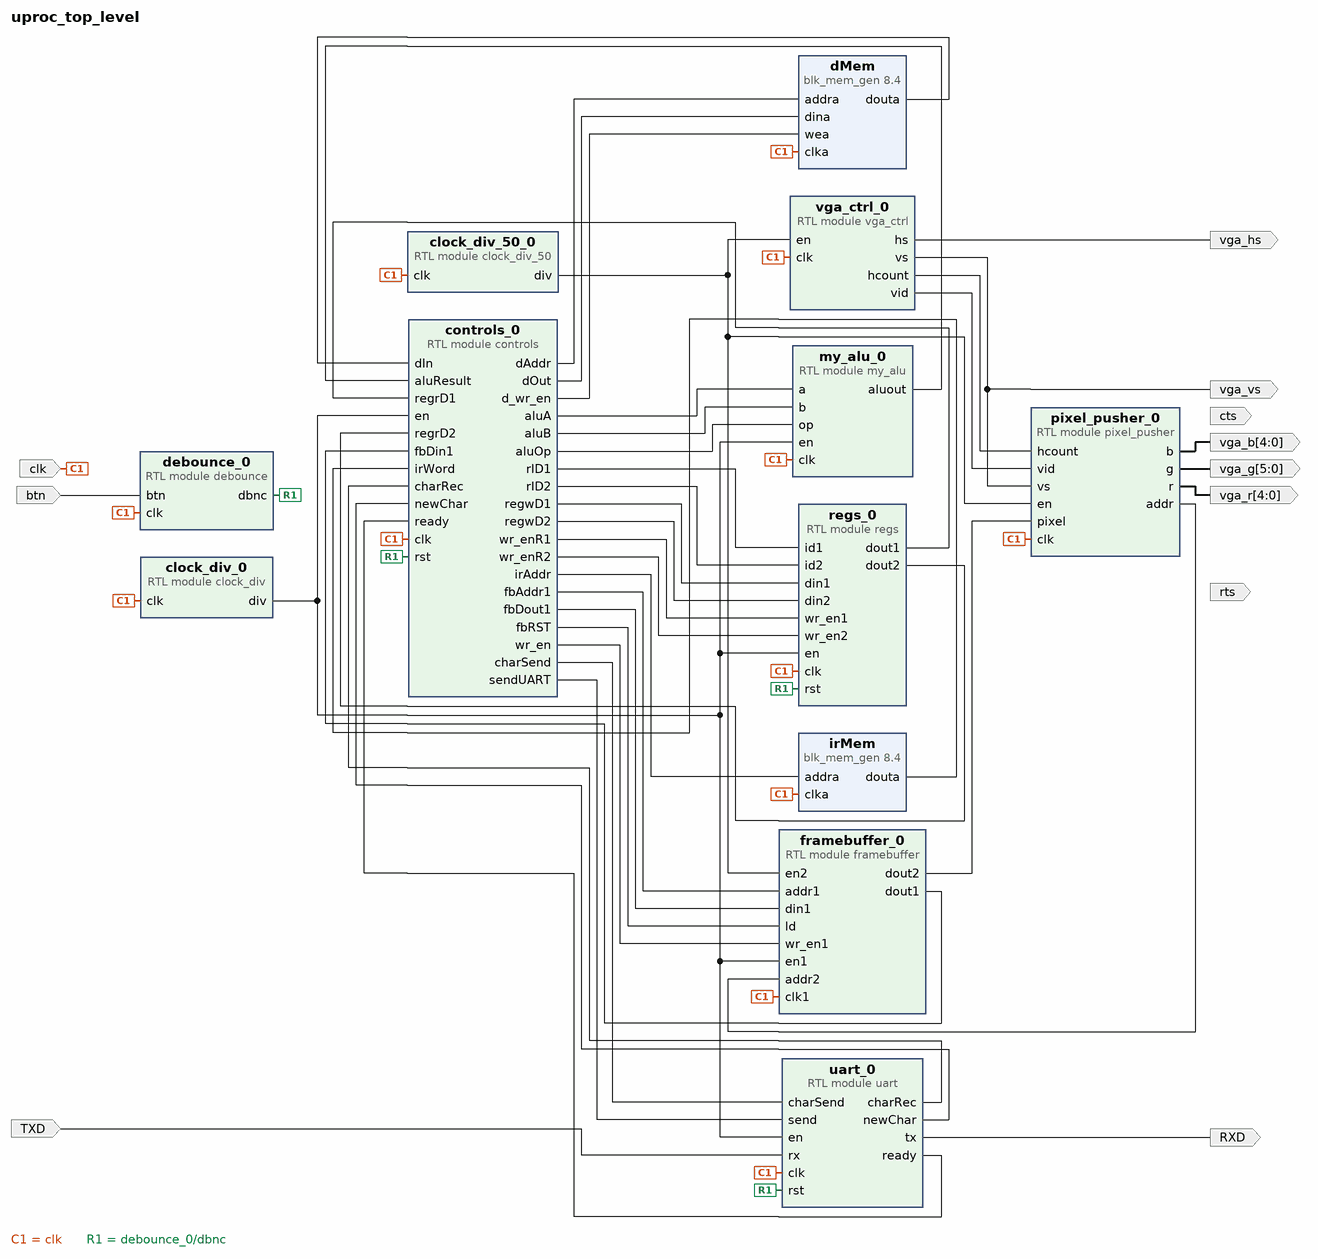
[diagram p0: block diagram of the top level]
# Vivado block design uproc_top_level, xc7z010clg400-1, Vivado 2021.1
create_bd_design uproc_top_level

create_bd_port -dir I -type clk clk
set_property -dict {CONFIG.FREQ_HZ 125000000} [get_bd_ports clk]
create_bd_port -dir I btn
create_bd_port -dir O vga_vs
create_bd_port -dir O vga_hs
create_bd_port -dir O -from 4 -to 0 vga_r
create_bd_port -dir O -from 4 -to 0 vga_b
create_bd_port -dir O -from 5 -to 0 vga_g
create_bd_port -dir O RXD
create_bd_port -dir I TXD
create_bd_port -dir O rts
create_bd_port -dir O cts

create_bd_cell -type module -reference regs regs_0
create_bd_cell -type module -reference vga_ctrl vga_ctrl_0
create_bd_cell -type module -reference framebuffer framebuffer_0
create_bd_cell -type module -reference clock_div clock_div_0
create_bd_cell -type module -reference clock_div_50 clock_div_50_0
create_bd_cell -type module -reference debounce debounce_0
create_bd_cell -type module -reference uart uart_0
create_bd_cell -type ip -vlnv xilinx.com:ip:blk_mem_gen:8.4 irMem
set_property -dict [list \
  CONFIG.Coe_File ../../../../../../../Downloads/drive-download-20250425T001836Z-001/output_text.coe \
  CONFIG.Enable_32bit_Address false \
  CONFIG.Enable_A Always_Enabled \
  CONFIG.Load_Init_File true \
  CONFIG.Memory_Type Single_Port_ROM \
  CONFIG.Port_A_Write_Rate 0 \
  CONFIG.Register_PortA_Output_of_Memory_Primitives true \
  CONFIG.Use_RSTA_Pin false \
  CONFIG.Write_Depth_A 16384 \
  CONFIG.use_bram_block Stand_Alone \
] [get_bd_cells irMem]
create_bd_cell -type ip -vlnv xilinx.com:ip:blk_mem_gen:8.4 dMem
set_property -dict [list \
  CONFIG.Coe_File ../../../../../../../Downloads/drive-download-20250425T001836Z-001/output_data.coe \
  CONFIG.Enable_32bit_Address false \
  CONFIG.Enable_A Always_Enabled \
  CONFIG.Load_Init_File true \
  CONFIG.Read_Width_A 16 \
  CONFIG.Register_PortA_Output_of_Memory_Primitives false \
  CONFIG.Use_Byte_Write_Enable false \
  CONFIG.Use_RSTA_Pin false \
  CONFIG.Write_Depth_A 32768 \
  CONFIG.Write_Width_A 16 \
  CONFIG.use_bram_block Stand_Alone \
] [get_bd_cells dMem]
create_bd_cell -type module -reference my_alu my_alu_0
create_bd_cell -type module -reference pixel_pusher pixel_pusher_0
create_bd_cell -type module -reference controls controls_0

# ---- connections ----

connect_bd_net -net btn_0_1 [get_bd_ports btn] [get_bd_pins debounce_0/btn]
connect_bd_net [get_bd_ports clk] \
  [get_bd_pins clock_div_0/clk] [get_bd_pins clock_div_50_0/clk] [get_bd_pins regs_0/clk] [get_bd_pins framebuffer_0/clk1] \
  [get_bd_pins vga_ctrl_0/clk] [get_bd_pins uart_0/clk] [get_bd_pins dMem/clka] [get_bd_pins irMem/clka] \
  [get_bd_pins debounce_0/clk] [get_bd_pins my_alu_0/clk] [get_bd_pins pixel_pusher_0/clk] [get_bd_pins controls_0/clk]
connect_bd_net [get_bd_pins clock_div_0/div] \
  [get_bd_pins framebuffer_0/en1] [get_bd_pins regs_0/en] [get_bd_pins uart_0/en] [get_bd_pins my_alu_0/en] \
  [get_bd_pins controls_0/en]
connect_bd_net [get_bd_pins clock_div_50_0/div] [get_bd_pins framebuffer_0/en2] [get_bd_pins vga_ctrl_0/en] [get_bd_pins pixel_pusher_0/en]
connect_bd_net [get_bd_pins controls_0/aluA] [get_bd_pins my_alu_0/a]
connect_bd_net [get_bd_pins controls_0/aluB] [get_bd_pins my_alu_0/b]
connect_bd_net [get_bd_pins controls_0/aluOp] [get_bd_pins my_alu_0/op]
connect_bd_net [get_bd_pins controls_0/charSend] [get_bd_pins uart_0/charSend]
connect_bd_net [get_bd_pins controls_0/dAddr] [get_bd_pins dMem/addra]
connect_bd_net [get_bd_pins controls_0/dOut] [get_bd_pins dMem/dina]
connect_bd_net [get_bd_pins controls_0/d_wr_en] [get_bd_pins dMem/wea]
connect_bd_net [get_bd_pins controls_0/fbAddr1] [get_bd_pins framebuffer_0/addr1]
connect_bd_net [get_bd_pins controls_0/fbDout1] [get_bd_pins framebuffer_0/din1]
connect_bd_net [get_bd_pins controls_0/fbRST] [get_bd_pins framebuffer_0/ld]
connect_bd_net [get_bd_pins controls_0/irAddr] [get_bd_pins irMem/addra]
connect_bd_net [get_bd_pins controls_0/rID1] [get_bd_pins regs_0/id1]
connect_bd_net [get_bd_pins controls_0/rID2] [get_bd_pins regs_0/id2]
connect_bd_net [get_bd_pins controls_0/regwD1] [get_bd_pins regs_0/din1]
connect_bd_net [get_bd_pins controls_0/regwD2] [get_bd_pins regs_0/din2]
connect_bd_net [get_bd_pins controls_0/sendUART] [get_bd_pins uart_0/send]
connect_bd_net [get_bd_pins controls_0/wr_en] [get_bd_pins framebuffer_0/wr_en1]
connect_bd_net [get_bd_pins controls_0/wr_enR1] [get_bd_pins regs_0/wr_en1]
connect_bd_net [get_bd_pins controls_0/wr_enR2] [get_bd_pins regs_0/wr_en2]
connect_bd_net [get_bd_pins dMem/douta] [get_bd_pins controls_0/dIn]
connect_bd_net [get_bd_pins debounce_0/dbnc] [get_bd_pins regs_0/rst] [get_bd_pins uart_0/rst] [get_bd_pins controls_0/rst]
connect_bd_net [get_bd_pins framebuffer_0/dout1] [get_bd_pins controls_0/fbDin1]
connect_bd_net [get_bd_pins framebuffer_0/dout2] [get_bd_pins pixel_pusher_0/pixel]
connect_bd_net [get_bd_pins irMem/douta] [get_bd_pins controls_0/irWord]
connect_bd_net -net my_alu_0_output [get_bd_pins my_alu_0/aluout] [get_bd_pins controls_0/aluResult]
connect_bd_net [get_bd_pins pixel_pusher_0/addr] [get_bd_pins framebuffer_0/addr2]
connect_bd_net [get_bd_pins pixel_pusher_0/b] [get_bd_ports vga_b]
connect_bd_net [get_bd_pins pixel_pusher_0/g] [get_bd_ports vga_g]
connect_bd_net [get_bd_pins pixel_pusher_0/r] [get_bd_ports vga_r]
connect_bd_net [get_bd_pins regs_0/dout1] [get_bd_pins controls_0/regrD1]
connect_bd_net [get_bd_pins regs_0/dout2] [get_bd_pins controls_0/regrD2]
connect_bd_net -net rx_0_1 [get_bd_ports TXD] [get_bd_pins uart_0/rx]
connect_bd_net [get_bd_pins uart_0/charRec] [get_bd_pins controls_0/charRec]
connect_bd_net [get_bd_pins uart_0/newChar] [get_bd_pins controls_0/newChar]
connect_bd_net [get_bd_pins uart_0/ready] [get_bd_pins controls_0/ready]
connect_bd_net [get_bd_pins uart_0/tx] [get_bd_ports RXD]
connect_bd_net [get_bd_pins vga_ctrl_0/hcount] [get_bd_pins pixel_pusher_0/hcount]
connect_bd_net [get_bd_pins vga_ctrl_0/hs] [get_bd_ports vga_hs]
connect_bd_net [get_bd_pins vga_ctrl_0/vid] [get_bd_pins pixel_pusher_0/vid]
connect_bd_net [get_bd_pins vga_ctrl_0/vs] [get_bd_ports vga_vs] [get_bd_pins pixel_pusher_0/vs]

validate_bd_design
save_bd_design
